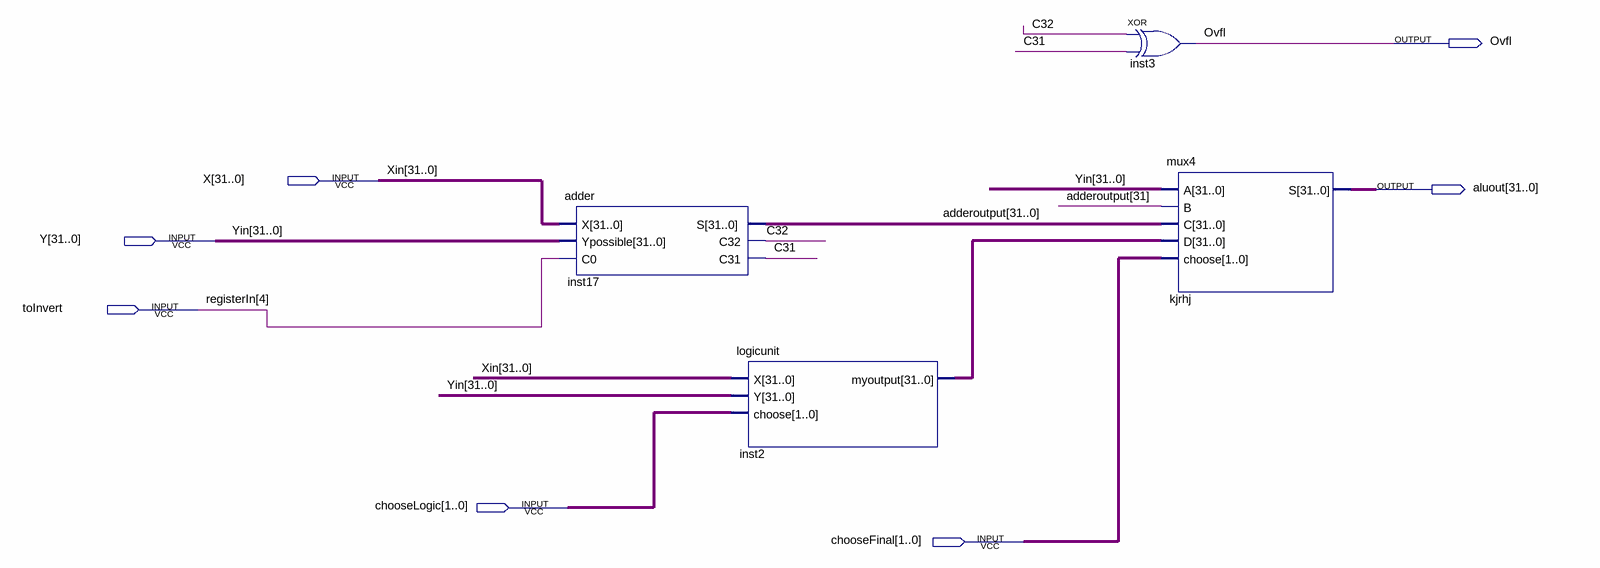
[diagram p0: schematic sheet]
// Quartus schematic ALU.bdf as structural Verilog: 4 symbols, 7 pins
module ALU (
  input  [31:0] X,
  input  [31:0] Y,
  input  toInvert,
  input  [1:0] chooseLogic,
  input  [1:0] chooseFinal,
  output Ovfl,
  output [31:0] aluout
);

  wire C31, C32;
  wire [31:0] adderoutput, inst2_myoutput;

  adder inst17 (.X(X), .Ypossible(Y), .C0(toInvert), .S(adderoutput), .C32(C32), .C31(C31));
  logicunit inst2 (.X(X), .Y(Y), .choose(chooseLogic), .myoutput(inst2_myoutput));
  xor inst3 (Ovfl, C32, C31);
  mux4 kjrhj (.A(Y), .B(adderoutput[31]), .C(adderoutput), .D(inst2_myoutput), .choose(chooseFinal), .S(aluout));

  // Other names for the same wires on the sheet: registerIn[4] = toInvert; Xin[31:0] = X; Yin[31:0] = Y
endmodule
